# EAGLE design BarBot 2012 Tower (EAGLE 6.3)

## Sheet 1 of 2
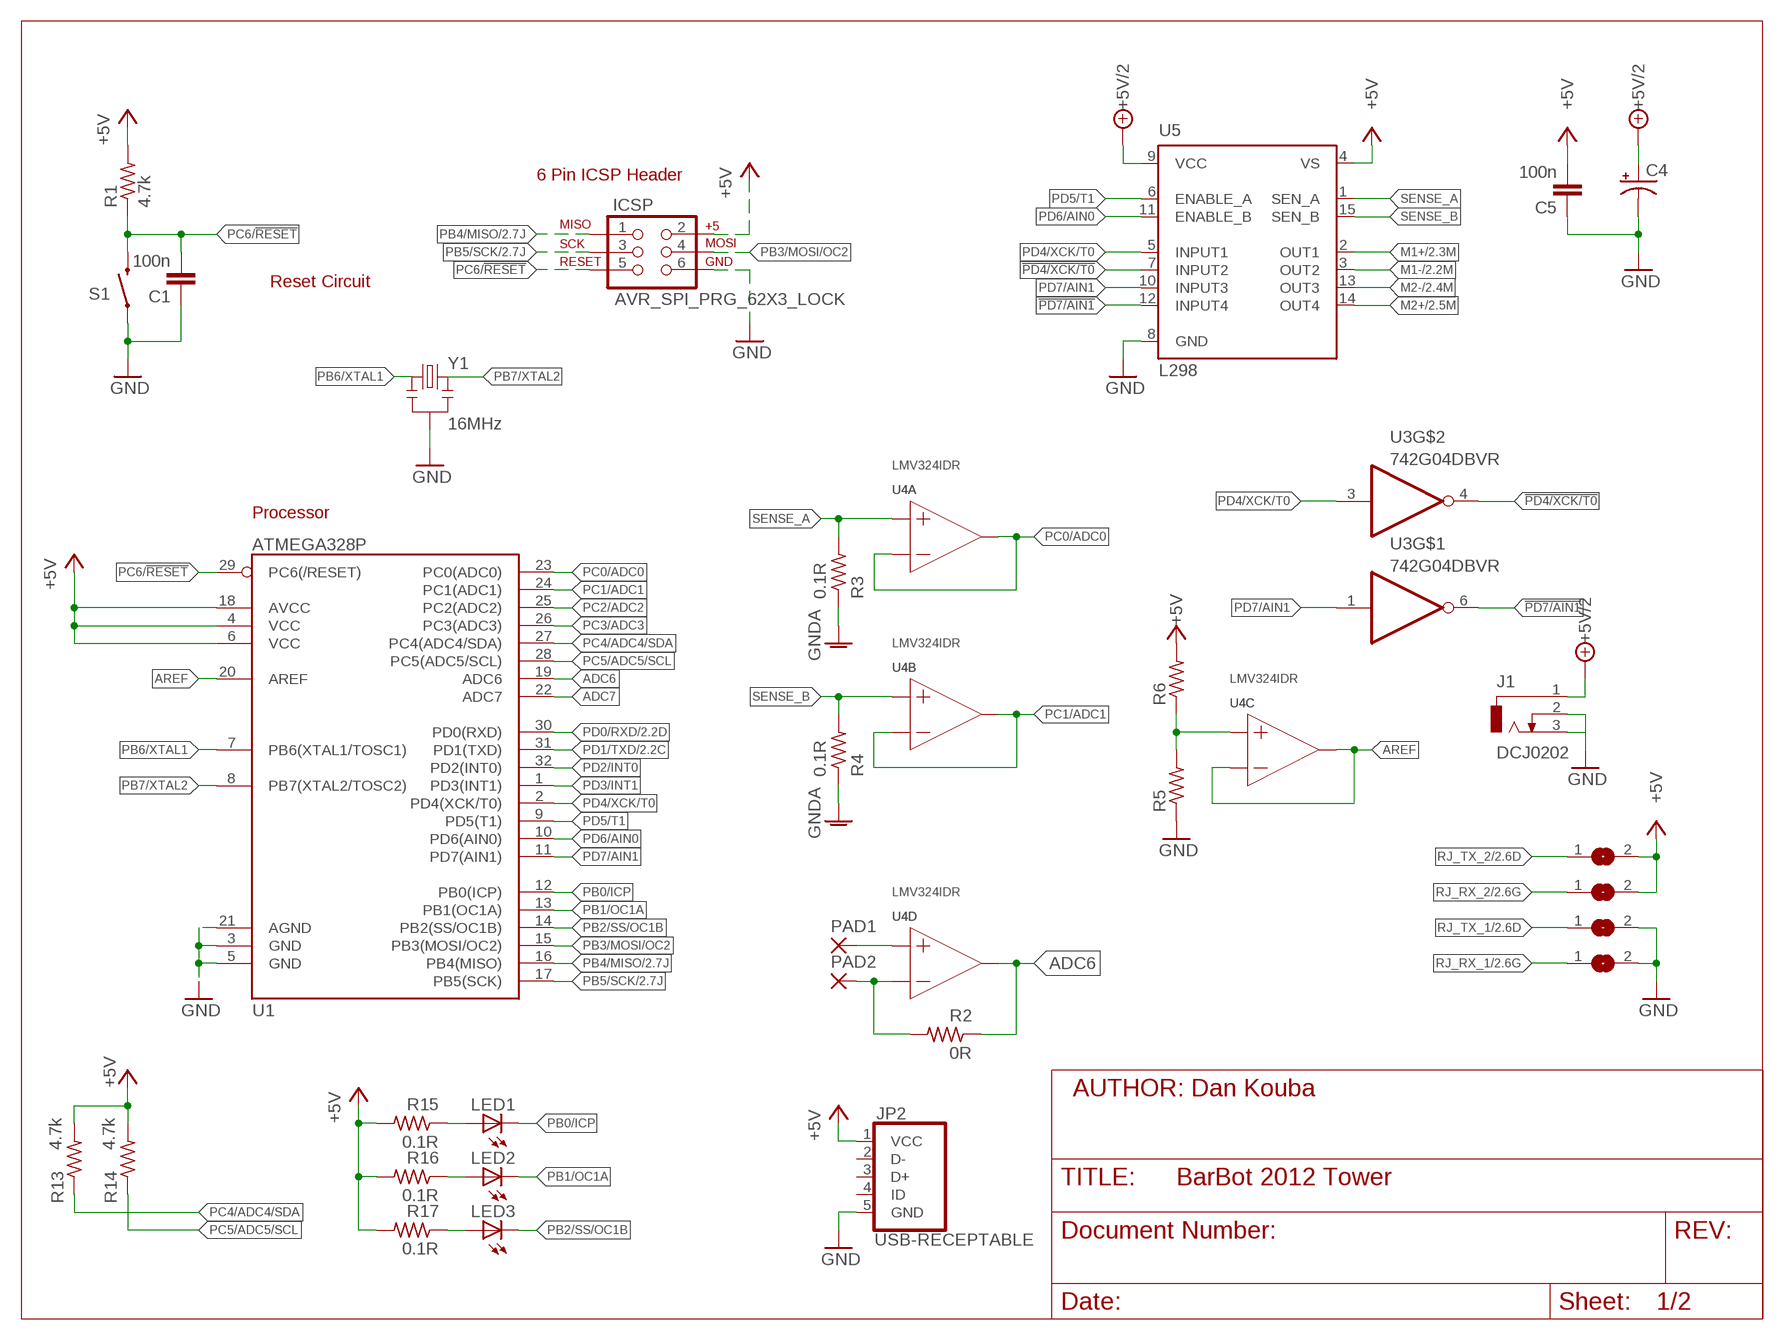
[diagram p0: schematic, sheet 1]

### Parts
C1  100n  C-EUC0805  [C0805]
C4  CPOL-USE3.5-8  [E3,5-8]
C5  100n  C-EUC0805  [C0805]
ICSP  AVR_SPI_PRG_62X3_LOCK  [2X3_LOCK]
J1  DCJ0202  [DCJ0202]
JP2  USB-RECEPTABLE  [FCI-10103594-0001LF]
LED1  LEDCHIPLED_0805  [CHIPLED_0805]
LED2  LEDCHIPLED_0805  [CHIPLED_0805]
LED3  LEDCHIPLED_0805  [CHIPLED_0805]
PAD1  1,6/0,8  [1,6/0,8]
PAD2  1,6/0,8  [1,6/0,8]
R1  4.7k  R-US_R0805  [R0805]
R2  0R  R-US_R0805  [R0805]
R3  0.1R  R-US_R0805  [R0805]
R4  0.1R  R-US_R0805  [R0805]
R5  R-US_R0805  [R0805]
R6  R-US_R0805  [R0805]
R13  4.7k  R-US_R0805  [R0805]
R14  4.7k  R-US_R0805  [R0805]
R15  0.1R  R-US_R0805  [R0805]
R16  0.1R  R-US_R0805  [R0805]
R17  0.1R  R-US_R0805  [R0805]
S1  SWITCH-MOMENTARY-2PTH  [TACTILE-PTH]
SJ1  SJ  [SJ]
SJ2  SJ  [SJ]
SJ3  SJ  [SJ]
SJ4  SJ  [SJ]
U1  ATMEGA328P  ATMEGA328_SMT  [TQFP32-08]
U3  742G04DBVR  [DBV_R-PDSO-G6]
U4  LMV324IDR  [SO14]
U5  L298  [MULTIWATT-15]
Y1  16MHz  RESONATOR16MHZ  [RESONATOR-SMD]

### Nets
!PD4/XCK/T0: U3.4(O) U5.7(INPUT2)
!PD7/AIN1: U3.6(O) U5.12(INPUT4)
+5V: C5.2 ICSP.2 JP2.1(VCC) R1.2 R6.2 R13.2 R14.2 R15.2 R16.2 R17.2 SJ3.2 SJ4.2 U1.4(VCC) U1.6(VCC) U1.18(AVCC) U5.4(VS) ; also sheet 2
+5V/2: C4.+ J1.1 U5.9(VCC) ; also sheet 2
ADC6: R2.1 U1.19(ADC6) U4.14(D:OUT)
ADC7: U1.22(ADC7)
AREF: U1.20(AREF) U4.8(C:OUT) U4.9(C:-IN)
GND: C1.1 C4.- C5.1 ICSP.6 J1.2 J1.3 JP2.5(GND) R3.1 R4.1 R5.1 S1.1 SJ1.2 SJ2.2 U1.3(GND) U1.5(GND) U1.21(AGND) U5.8(GND) Y1.2 ; supply symbol labelled GNDA ; also sheet 2
M1+: U5.2(OUT1) ; also sheet 2
M1-: U5.3(OUT2) ; also sheet 2
M2+: U5.14(OUT4) ; also sheet 2
M2-: U5.13(OUT3) ; also sheet 2
N$2: LED1.A R15.1
N$3: PAD2.1(P) R2.2 U4.13(D:-IN)
N$4: LED2.A R16.1
N$5: LED3.A R17.1
N$10: R5.2 R6.1 U4.10(C:+IN)
PB0/ICP: LED1.C U1.12(PB0(ICP))
PB1/OC1A: LED2.C U1.13(PB1(OC1A))
PB2/SS/OC1B: LED3.C U1.14(PB2(SS/OC1B))
PB3/MOSI/OC2: ICSP.4 U1.15(PB3(MOSI/OC2))
PB4/MISO: ICSP.1 U1.16(PB4(MISO)) ; also sheet 2
PB5/SCK: ICSP.3 U1.17(PB5(SCK)) ; also sheet 2
PB6/XTAL1: U1.7(PB6(XTAL1/TOSC1)) Y1.1
PB7/XTAL2: U1.8(PB7(XTAL2/TOSC2)) Y1.3
PC0/ADC0: U1.23(PC0(ADC0)) U4.1(A:OUT) U4.2(A:-IN)
PC1/ADC1: U1.24(PC1(ADC1)) U4.6(B:-IN) U4.7(B:OUT)
PC2/ADC2: U1.25(PC2(ADC2))
PC3/ADC3: U1.26(PC3(ADC3))
PC4/ADC4/SDA: R13.1 U1.27(PC4(ADC4/SDA))
PC5/ADC5/SCL: R14.1 U1.28(PC5(ADC5/SCL))
PC6/!RESET: C1.2 ICSP.5 R1.1 S1.3 U1.29(PC6(/RESET))
PD0/RXD: U1.30(PD0(RXD)) ; also sheet 2
PD1/TXD: U1.31(PD1(TXD)) ; also sheet 2
PD2/INT0: U1.32(PD2(INT0))
PD3/INT1: U1.1(PD3(INT1))
PD4/XCK/T0: U1.2(PD4(XCK/T0)) U3.3(I) U5.5(INPUT1)
PD5/T1: U1.9(PD5(T1)) U5.6(ENABLE_A)
PD6/AIN0: U1.10(PD6(AIN0)) U5.11(ENABLE_B)
PD7/AIN1: U1.11(PD7(AIN1)) U3.1(I) U5.10(INPUT3)
RJ_RX_1: SJ2.1 ; also sheet 2
RJ_RX_2: SJ4.1 ; also sheet 2
RJ_TX_1: SJ1.1 ; also sheet 2
RJ_TX_2: SJ3.1 ; also sheet 2
SENSE_A: R3.2 U4.3(A:+IN) U5.1(SEN_A)
SENSE_B: R4.2 U4.5(B:+IN) U5.15(SEN_B)
TP1: PAD1.1(P) U4.12(D:+IN)
Unconnected: JP2.2(D-) JP2.3(D+) JP2.4(ID)

### Notes on the sheet
- 6 Pin ICSP Header
- Reset Circuit
- Processor
- AUTHOR: Dan Kouba

## Sheet 2 of 2
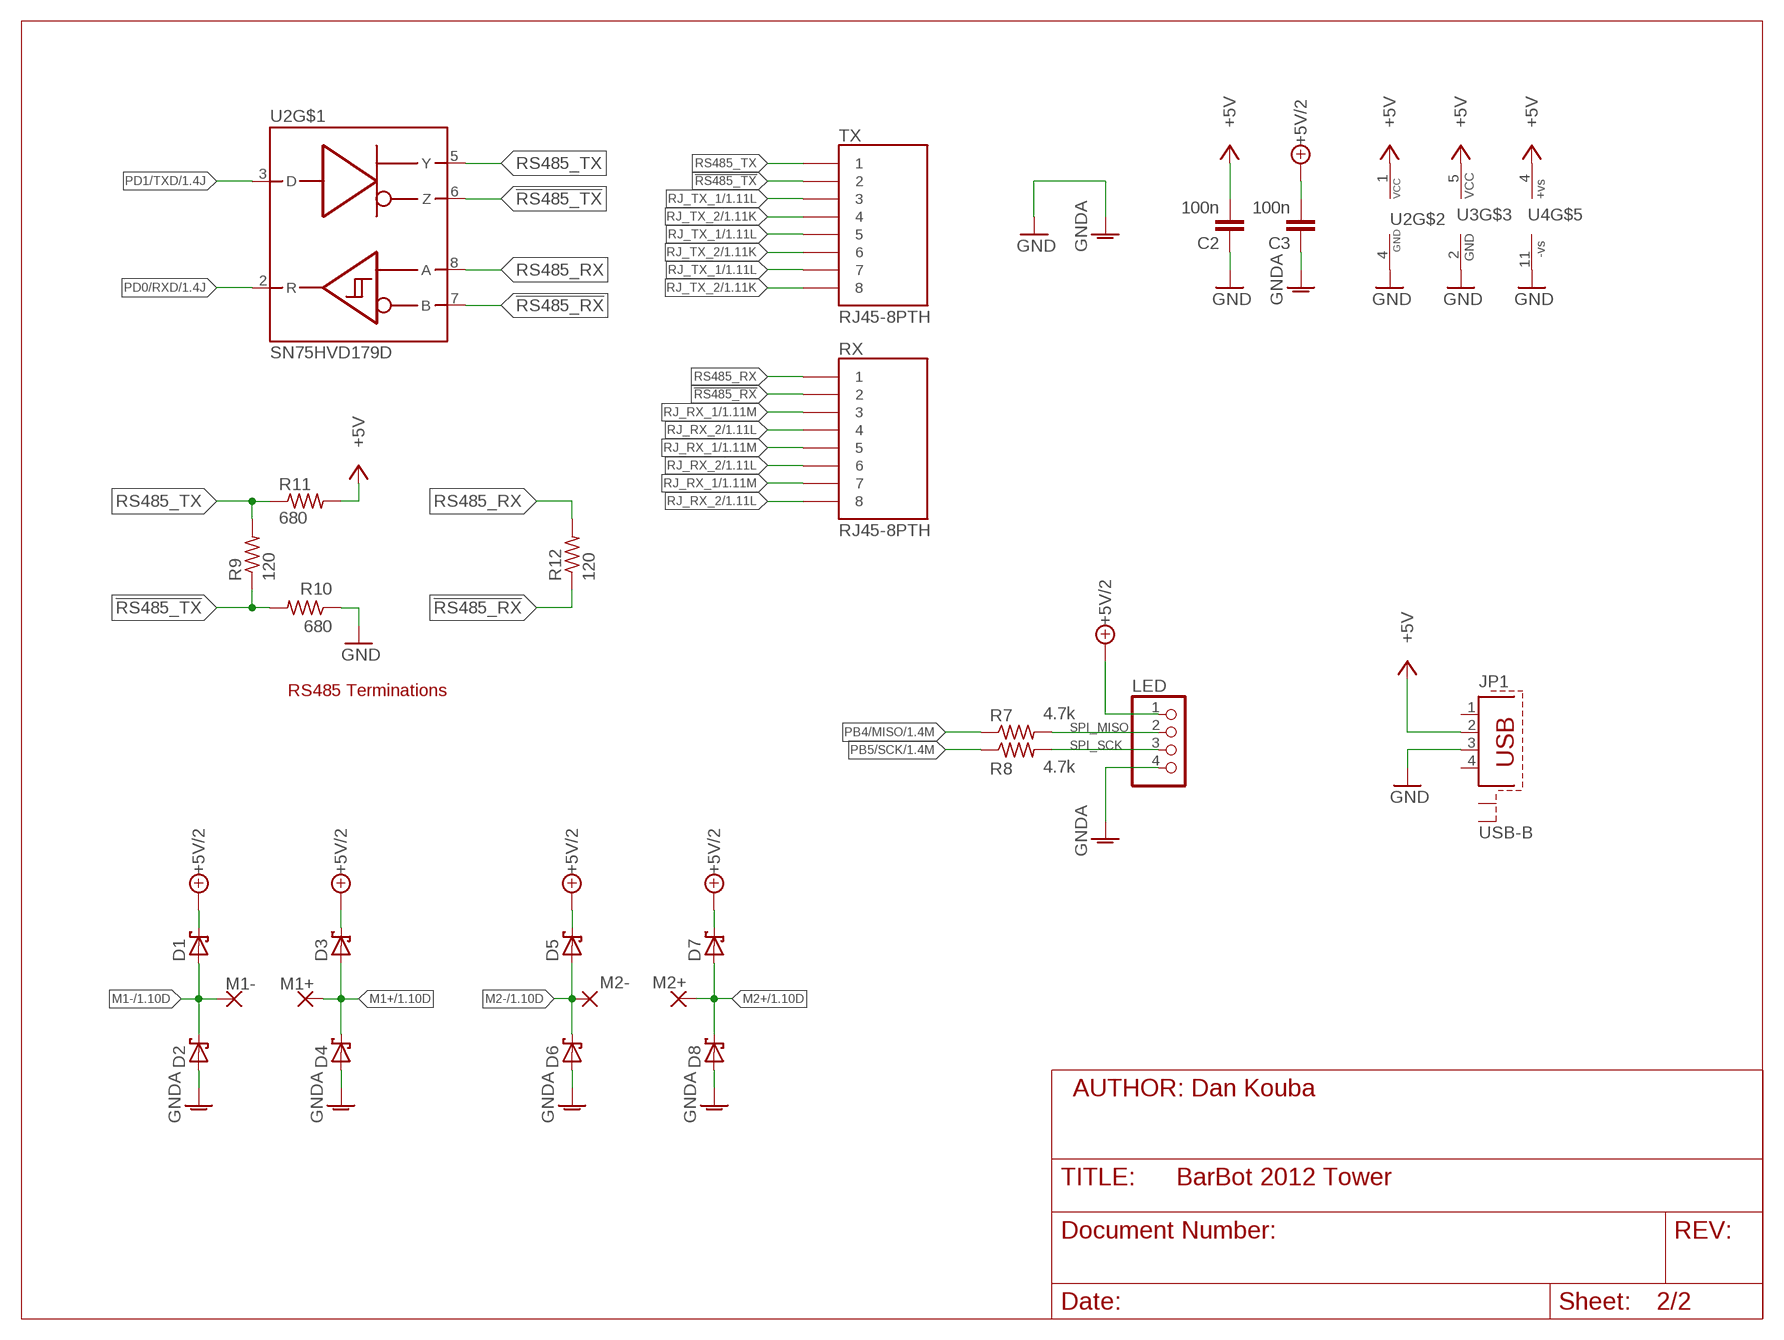
[diagram p1: schematic, sheet 2]

### Parts
C2  100n  C-EUC0805  [C0805]
C3  100n  C-EUC0805  [C0805]
D1  SCHOTTKY-DIODESMD  [SMB]
D2  SCHOTTKY-DIODESMD  [SMB]
D3  SCHOTTKY-DIODESMD  [SMB]
D4  SCHOTTKY-DIODESMD  [SMB]
D5  SCHOTTKY-DIODESMD  [SMB]
D6  SCHOTTKY-DIODESMD  [SMB]
D7  SCHOTTKY-DIODESMD  [SMB]
D8  SCHOTTKY-DIODESMD  [SMB]
JP1  USB-B  PN61729-S  [PN61729-S]
LED  PINHD-1X4  [1X04]
M1+  3,81/1,1  [3,81/1,1]
M1-  3,81/1,1  [3,81/1,1]
M2+  3,81/1,1  [3,81/1,1]
M2-  3,81/1,1  [3,81/1,1]
R7  4.7k  R-US_R0805  [R0805]
R8  4.7k  R-US_R0805  [R0805]
R9  120  R-US_R0805  [R0805]
R10  680  R-US_R0805  [R0805]
R11  680  R-US_R0805  [R0805]
R12  120  R-US_R0805  [R0805]
RX  RJ45-8PTH  [RJ45-8]
TX  RJ45-8PTH  [RJ45-8]
U2  SN75HVD179D  [SO-08]

### Nets
!RS485_RX: R12.1 RX.2 U2.7(B)
!RS485_TX: R9.1 R10.2 TX.2 U2.6(Z)
+5V: C2.2 JP1.2 R11.2 U2.1(VCC) U3.5(VCC) U4.4(+VS) ; also sheet 1
+5V/2: C3.2 D1.C D3.C D5.C D7.C LED.1 ; also sheet 1
GND: C2.1 C3.1 D2.A D4.A D6.A D8.A JP1.3 LED.4 R10.1 U2.4(GND) U3.2(GND) U4.11(-VS) ; supply symbol labelled GNDA ; also sheet 1
M1+: D3.A D4.C M1+.1(P) ; also sheet 1
M1-: D1.A D2.C M1-.1(P) ; also sheet 1
M2+: D7.A D8.C M2+.1(P) ; also sheet 1
M2-: D5.A D6.C M2-.1(P) ; also sheet 1
PB4/MISO: R7.1 ; also sheet 1
PB5/SCK: R8.1 ; also sheet 1
PD0/RXD: U2.2(R) ; also sheet 1
PD1/TXD: U2.3(D) ; also sheet 1
RJ_RX_1: RX.3 RX.5 RX.7 ; also sheet 1
RJ_RX_2: RX.4 RX.6 RX.8 ; also sheet 1
RJ_TX_1: TX.3 TX.5 TX.7 ; also sheet 1
RJ_TX_2: TX.4 TX.6 TX.8 ; also sheet 1
RS485_RX: R12.2 RX.1 U2.8(A)
RS485_TX: R9.2 R11.1 TX.1 U2.5(Y)
SPI_MISO: LED.2 R7.2
SPI_SCK: LED.3 R8.2
Unconnected: JP1.1 JP1.4 JP1.S1 JP1.S2

### Notes on the sheet
- RS485 Terminations
- AUTHOR: Dan Kouba

## Library data of the parts
C1-C3 C5 = rcl:C-EU: CAPACITOR, European symbol
C4 = rcl:CPOL-US: POLARIZED CAPACITOR, American symbol
D1-D8 = diode:SCHOTTKY-DIODE: Schottky Diode; DIGIKEY_PN: S320FSCT-ND
ICSP = SparkFun-Connectors:AVR_SPI_PRG_6: AVR ISP 6 Pin This is the reduced ISP connector for AVR programming. Common on Arduino. This footprint will take up less PCB space and can be used with a 10-pin to 6-pin adapter such as SKU: BOB-08508
J1 = con-jack:DCJ0202: DC POWER JACK Source: DCJ0202.pdf; OC_FARNELL: unknown; OC_NEWARK: unknown
JP1 = con-berg:PN61729-S: BERG USB connector; OC_FARNELL: unknown; OC_NEWARK: unknown
JP2 = daspilker:USB-RECEPTABLE: USB Receptable
LED = pinhead:PINHD-1X4: PIN HEADER
LED1-LED3 = led:LED: LED OSRAM: - CHIPLED LG R971, LG N971, LY N971, LG Q971, LY Q971, LO R971, LY R971 LH N974, LH R974 LS Q976, LO Q976, LY Q976 LO Q996 - Hyper CHIPLED LW Q18S LB Q993, LB Q99A, LB R99A - SideLED LS A670, LO A670, LY A670, LG A670, LP A670 LB A673, LV A673, LT A673, LW A673 LH A674 LY A675 LS A676, LA A676, LO A676, LY A676, LW A676 LS A679, LY A679, LG A679 - Hyper Micro SIDELED® LS Y876, LA Y876, LO Y876, LY Y876 LT Y87S - SmartLED LW L88C, LW L88S LB L89C, LB L89S, LG L890 LS L89K, LO L89K, LY L89K LS L896, LA L896, LO L896, LY L896 - TOPLED LS T670, LO T670, LY T670, LG T670, LP T670 LSG T670, LSP T670, LSY T670, LOP T670, LYG T670 LG T671, LOG T671, LSG T671 LB T673, LV T673, LT T673, LW T673 LH T674 LS T676, LA T676, LO T676, LY T676, LB T676, LH T676, LSB T676, LW T676 LB T67C, LV T67C, LT T67C, LS T67K, LO T67K, LY T67K, LW E67C LS E67B, LA E67B, LO E67B, LY E67B, LB E67C, LV E67C, LT E67C LW T67C LS T679, LY T679, LG T679 LS T770, LO T770, LY T770, LG T770, LP T770 LB T773, LV T773, LT T773, LW T773 LH T774 LS E675, LA E675, LY E675, LS T675 LS T776, LA T776, LO T776, LY T776, LB T776 LHGB T686 LT T68C, LB T68C - Hyper Mini TOPLED® LB M676 - Mini TOPLED Santana® LG M470 LS M47K, LO M47K, LY M47K Source: http://www.osram.convergy.de LUXEON: - LUMILED® LXK2-PW12-R00, LXK2-PW12-S00, LXK2-PW14-U00, LXK2-PW14-V00 LXK2-PM12-R00, LXK2-PM12-S00, LXK2-PM14-U00 LXK2-PE12-Q00, LXK2-PE12-R00, LXK2-PE12-S00, LXK2-PE14-T00, LXK2-PE14-U00 LXK2-PB12-K00, LXK2-PB12-L00, LXK2-PB12-M00, LXK2-PB14-N00, LXK2-PB14-P00, LXK2-PB14-Q00 LXK2-PR12-L00, LXK2-PR12-M00, LXK2-PR14-Q00, LXK2-PR14-R00 LXK2-PD12-Q00, LXK2-PD12-R00, LXK2-PD12-S00 LXK2-PH12-R00, LXK2-PH12-S00 LXK2-PL12-P00, LXK2-PL12-Q00, LXK2-PL12-R00 Source: www.luxeon.com KINGBRIGHT: KA-3528ASYC Source: www.kingbright.com
M1+ M1- M2+ M2- = wirepad:3,81/1,1: THROUGH-HOLE PAD
PAD1 PAD2 = wirepad:1,6/0,8: THROUGH-HOLE PAD
R1 R5-R12 = rcl:R-US_: RESISTOR, American symbol
R2-R4 R13-R17 = rcl:R-US_: RESISTOR, American symbol; DIGIKEY_PN: RHM.10MCT-ND
RX TX = SparkFun-Connectors:RJ45-8: RJ45 Jack Simple RJ45, 8-pin connection - connector for common Cat5, Cat5e, and Cat6 Ethernet cables. Footprint not yet proven in production. Connector sku is PRT-00643; Breakout PCB sku is BOB-00716.
S1 = SparkFun-Electromechanical:SWITCH-MOMENTARY-2: Various NO switches- pushbuttons, reed, etc
SJ1-SJ4 = jumper:SJ: SMD solder JUMPER
U1 = SparkFun-DigitalIC:ATMEGA328_SMT: 32-Pin Atmega328 part Commonly used on Arduino compatible boards Available in QFP and QFN packages TQFP is IC-09069 QFN is non-stock; PROD_ID: IC-09069
U2 = texas:SN75HVD179: 5V FULL-DUPLEX RS-485/RS-422 DRIVER AND BALANCED RECEIVER - Up to 64 nodes per bus - 15kV ESD protection - Bus-Fault protection of -7V to 12V - SOIC8 Package
U3 = 74xx-little-us:74*2G04
U4 = bb_parts_OpAmp:LMV324: LOW-VOLTAGE RAIL-TO-RAIL OUTPUT OPERATIONAL AMPLIFIERS
U5 = st-microelectronics:L298: DUAL FULL-BRIDGE DRIVER; MPN: L298N; OC_FARNELL: 1589425; OC_NEWARK: 32M1527
Y1 = SparkFun-FreqCtrl:RESONATOR: Resonator Small SMD resonator. Used, eg, on the Arduino Pro/ Pro Mini boards. 8MHz- XTAL-08895 16MHz- XTAL-08900; PROD_ID: XTAL-08900

## Board
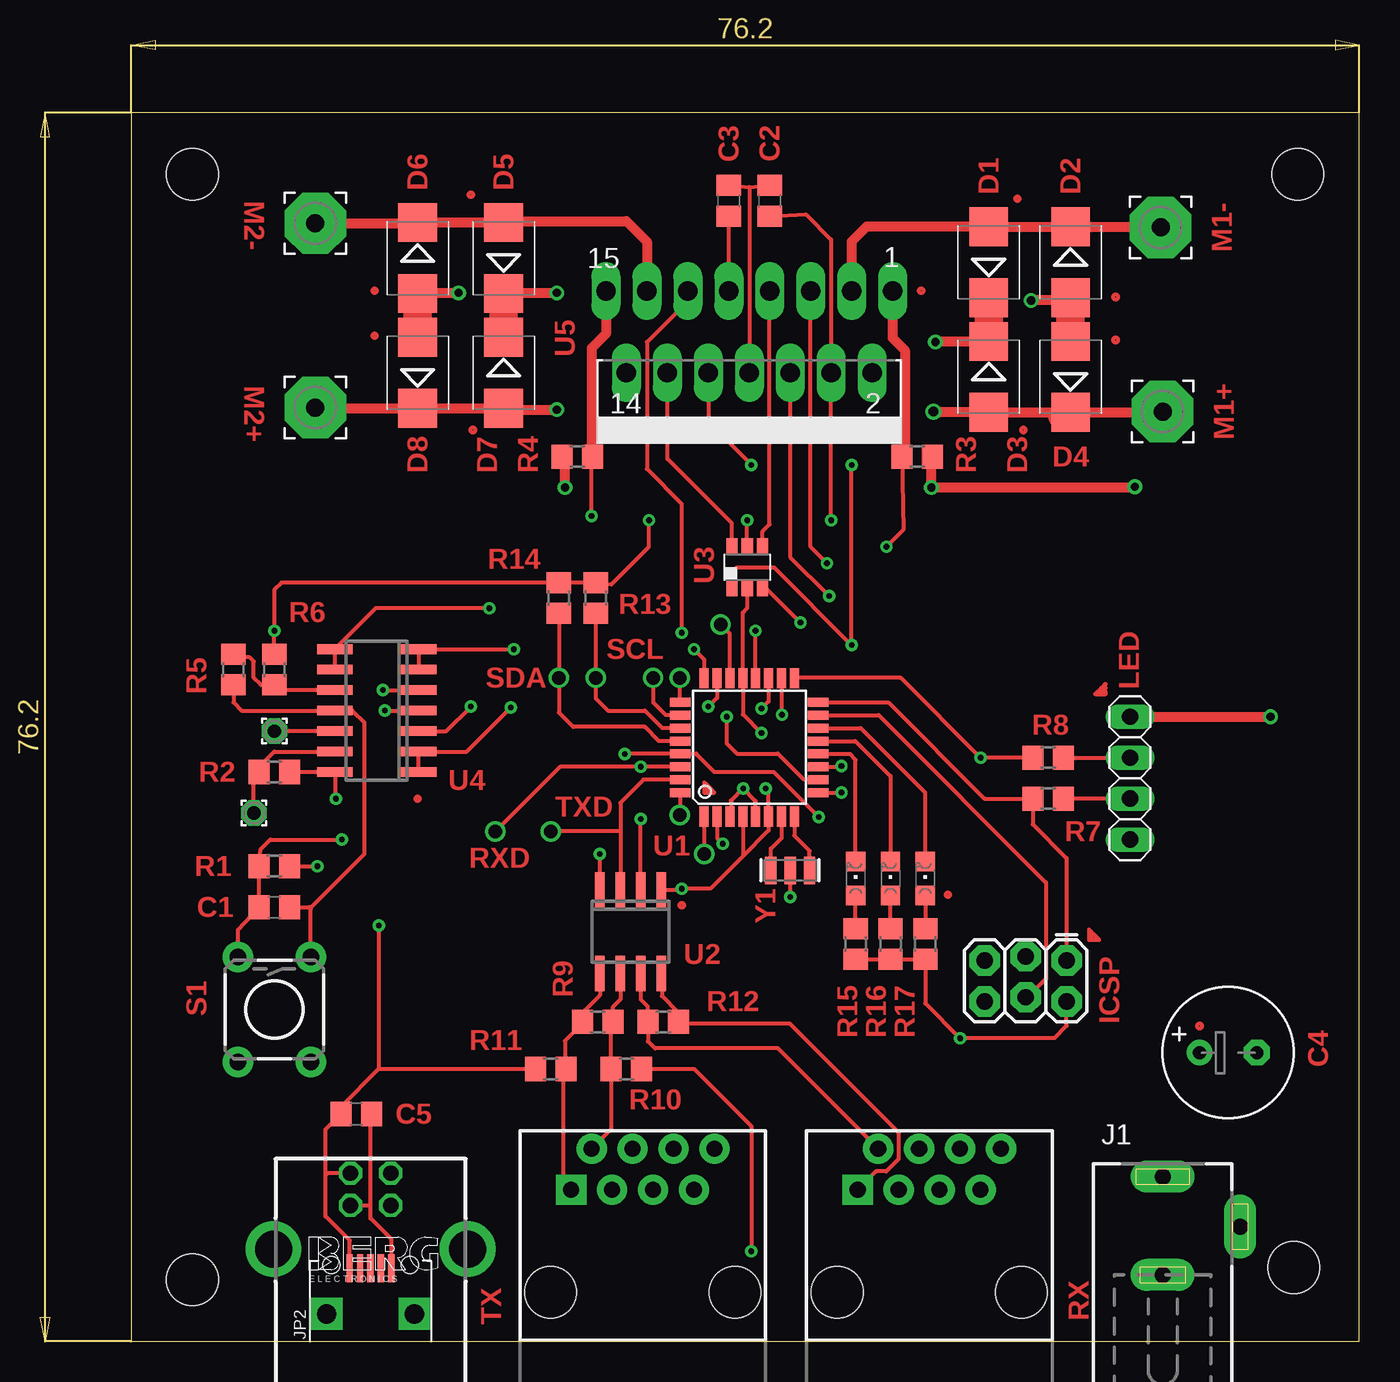
[diagram p2: board, top side]
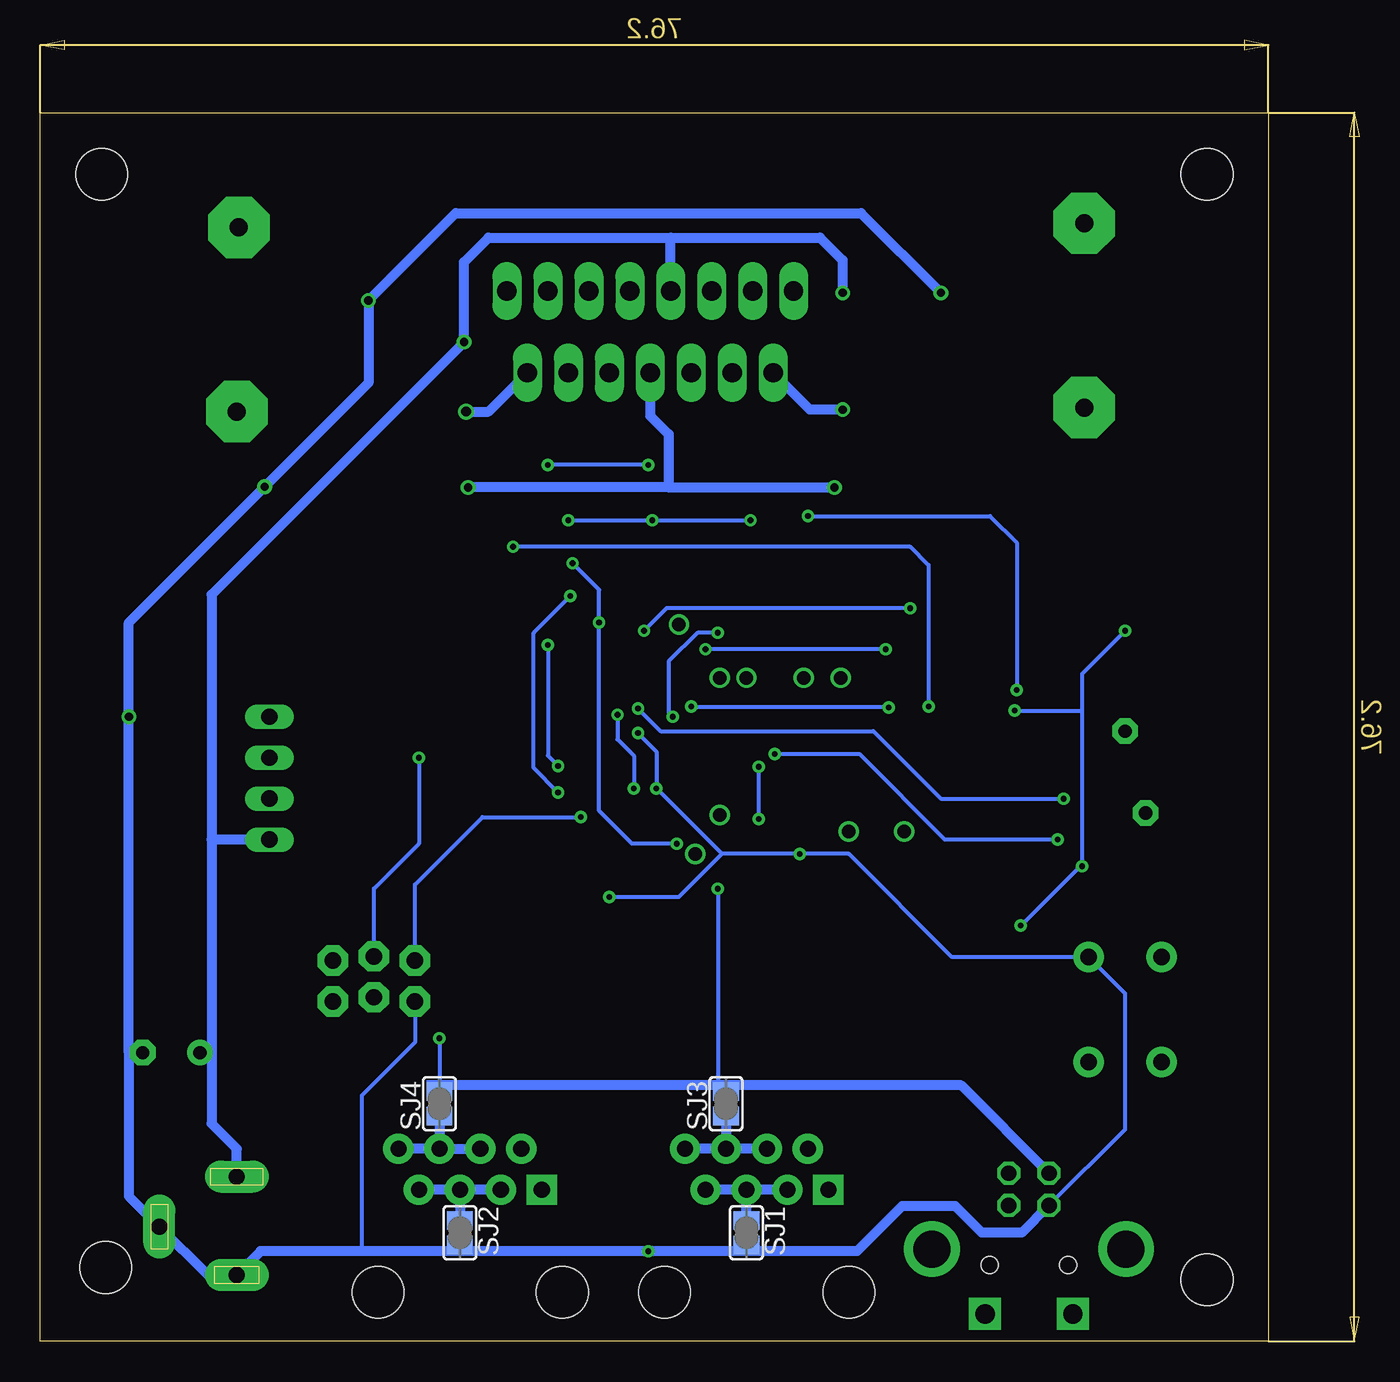
[diagram p3: board, bottom side, seen from below]

Size 76.2 x 76.2 mm. Coordinates in mm from the lower left corner, seen from the top.
Outline: 0,0 76.2,0 76.2,76.2 0,76.2 0,0
Copper layers (1*16): Top 0.0178mm / dielectric 59mil / Bottom 0.0178mm
Design rules "SSC-EAGLE-2Lyr_v1.0.0.3": minimum track width 6mil, minimum drill 14mil, track to track 6mil, track to pad 6mil, pad to pad 6mil, via to via 6mil, smd to smd 6mil, copper to edge 20mil, drill to drill 16mil, minimum pad ring 8mil, minimum via ring 8mil, stop-mask expansion 3mil, vias tented up to drill 0mil, thermal gap 10mil
Holes 3.2 mm at 3.81,72.39 72.39,72.39 72.14,4.57 3.81,3.81

### Footprints (pad centres in the part's own frame; a part is rotated, then mirrored left to right if it is on the bottom)
C0805 = smd 1.3 x 1.5: 1 -0.95,0; 2 0.95,0
E3,5-8 = drill 0.813 pad 1.6: + -1.778,0 | drill 0.813 pad 1.6 octagon: - 1.778,0
SMB = smd 2.4 x 2.4: A 2.2,0; C -2.2,0
2X3_LOCK = drill 1.016 pad 1.88 octagon: 1 0,0; 2 0,2.54; 3 2.54,-0.254; 4 2.54,2.286; 5 5.08,0; 6 5.08,2.54
DCJ0202 = drill 1 pad 2 long: 1 0,3.1; 2 4.8,0; 3 0,-3
PN61729-S = drill 0.95 octagon: 1 1.25,4.71; 2 -1.25,4.71; 3 -1.25,2.71; 4 1.25,2.71 | drill 2.3 pad 2.9: S1 -6.02,0; S2 6.02,0
FCI-10103594-0001LF = smd 0.4 x 1.75: 1 -1.3,4.525; 2 -0.65,4.525; 3 0,4.525; 4 0.65,4.525; 5 1.3,4.525 | drill 1.2 pad 2 square: P$3 -2.725,1.7; P$4 2.725,1.7 | hole 1.05: -2.425,4.73; 2.425,4.73
1X04 = drill 1.016 long: 1 -3.81,0; 2 -1.27,0; 3 1.27,0; 4 3.81,0
CHIPLED_0805 = smd 1.2 x 1.2: A 0,-1.05; C 0,1.05
3,81/1,1 = drill 1.118 pad 3.81 octagon: 1 0,0
1,6/0,8 = drill 0.813 pad 1.6 octagon: 1 0,0
R0805 = smd 1.3 x 1.5: 1 -0.95,0; 2 0.95,0
RJ45-8 = drill 1 pad 1.88 square: 1 -4.445,6.35 | drill 1 pad 1.88: 2 -3.175,8.89; 3 -1.905,6.35; 4 -0.635,8.89; 5 0.635,6.35; 6 1.905,8.89; 7 3.175,6.35; 8 4.445,8.89 | hole 3.2: -5.715,0; 5.715,0
TACTILE-PTH = drill 1.016 pad 1.88: 1 -3.251,2.261; 2 3.251,2.261; 3 -3.251,-2.261; 4 3.251,-2.261
SJ = smd 1.168 x 1.6: 1 -0.762,0; 2 0.762,0
TQFP32-08 = smd 1.27 x 0.559: 1 -4.293,2.8; 2 -4.293,2; 3 -4.293,1.2; 4 -4.293,0.4; 5 -4.293,-0.4; 6 -4.293,-1.2; 7 -4.293,-2; 8 -4.293,-2.8; 17 4.293,-2.8; 18 4.293,-2; 19 4.293,-1.2; 20 4.293,-0.4; 21 4.293,0.4; 22 4.293,1.2; 23 4.293,2; 24 4.293,2.8 | smd 0.559 x 1.27: 9 -2.8,-4.293; 10 -2,-4.293; 11 -1.2,-4.293; 12 -0.4,-4.293; 13 0.4,-4.293; 14 1.2,-4.293; 15 2,-4.293; 16 2.8,-4.293; 25 2.8,4.293; 26 2,4.293; 27 1.2,4.293; 28 0.4,4.293; 29 -0.4,4.293; 30 -1.2,4.293; 31 -2,4.293; 32 -2.8,4.293
SO-08 = smd 0.6 x 2.2: 1 -1.905,-2.6; 2 -0.635,-2.6; 3 0.635,-2.6; 4 1.905,-2.6; 5 1.905,2.6; 6 0.635,2.6; 7 -0.635,2.6; 8 -1.905,2.6
DBV_R-PDSO-G6 = smd 0.69 x 0.99: 1 -0.95,-1.29; 2 0,-1.29; 3 0.95,-1.29; 4 0.95,1.3; 5 0,1.3; 6 -0.95,1.3
SO14 = smd 0.6 x 2.2: 1 -3.81,-2.6; 2 -2.54,-2.6; 3 -1.27,-2.6; 4 0,-2.6; 5 1.27,-2.6; 6 2.54,-2.6; 7 3.81,-2.6; 8 3.81,2.6; 9 2.54,2.6; 10 1.27,2.6; 11 0,2.6; 12 -1.27,2.6; 13 -2.54,2.6; 14 -3.81,2.6
MULTIWATT-15 = drill 1.2 long: 1 -8.89,-7.62; 2 -7.62,-2.54; 3 -6.35,-7.62; 4 -5.08,-2.54; 5 -3.81,-7.62; 6 -2.54,-2.54; 7 -1.27,-7.62; 8 0,-2.54; 9 1.27,-7.62; 10 2.54,-2.54; 11 3.81,-7.62; 12 5.08,-2.54; 13 6.35,-7.62; 14 7.62,-2.54; 15 8.89,-7.62
RESONATOR-SMD = smd 0.7 x 1.7: 1 -1.2,0; 2 0,0; 3 1.2,0

### Placement (x,y rotation side)
C1  8.89,26.92 180 top
C2  39.62,70.74 270 top
C3  37.08,70.74 270 top
C4  68.07,17.91 0 top
C5  13.97,14.1 180 top
D1  53.21,66.93 90 top
D2  58.29,66.93 270 top
D3  53.21,59.82 270 top
D4  58.29,59.82 90 top
D5  23.11,67.18 90 top
D6  17.78,67.18 270 top
D7  23.11,60.07 270 top
D8  17.78,60.07 90 top
ICSP  58.04,23.62 180 top
J1  64.01,7.11 0 top
JP1  14.86,5.71 0 top
JP2  14.86,0 0 top
LED  61.98,34.92 90 top
LED1  44.96,28.7 0 top
LED2  47.12,28.7 0 top
LED3  49.28,28.7 0 top
M1+  64.01,57.66 0 top
M1-  63.88,69.09 0 top
M2+  11.43,57.91 0 top
M2-  11.43,69.34 0 top
PAD1  8.89,37.85 0 top
PAD2  7.62,32.77 0 top
R1  8.89,29.46 0 top
R2  8.89,35.31 180 top
R3  48.77,54.86 180 top
R4  27.69,54.86 0 top
R5  6.35,41.66 90 top
R6  8.89,41.66 90 top
R7  56.9,33.66 0 top
R8  56.9,36.2 0 top
R9  28.96,19.81 180 top
R10  30.73,16.89 180 top
R11  26.04,16.89 180 top
R12  33.02,19.81 0 top
R13  28.83,46.1 90 top
R14  26.54,46.1 90 top
R15  44.96,24.64 270 top
R16  47.12,24.64 270 top
R17  49.28,24.64 270 top
RX  49.53,3.05 0 top
S1  8.89,20.57 270 top
SJ1  32.38,6.73 270 bottom
SJ2  50.16,6.73 270 bottom
SJ3  33.66,14.73 90 bottom
SJ4  51.44,14.73 90 bottom
TX  31.75,3.05 0 top
U1  38.35,36.83 90 top
U2  30.99,25.4 180 top
U3  38.23,48.01 0 top
U4  15.24,39.12 90 top
U5  38.35,57.53 180 top
Y1  40.89,29.21 0 top

### Tracks (layer width: path | path; a pad name or v marks a point on that pad's centre or on a via)
!PD4/XCK/T0
  Top 0.254: U3.4 39.18,50.23 39.62,50.67 U5.7
!PD7/AIN1
  Top 0.254: U3.6 37.28,50.73 33.27,54.74 U5.12
!RS485_RX
  Top 0.254: U2.7 31.62,21.21 32.07,20.76 R12.1 32.07,18.6 32.51,18.16 40.13,18.16 RX.2
!RS485_TX
  Top 0.254: 29.97,19.65 R9.1 | U2.6 30.35,21.21 29.91,20.76 R9.1 | TX.2 29.78,13.15 R10.2 29.78,19.69 R9.1
  Top 0.406: 29.88,17.02 R10.2 | 29.88,19.73 R9.1
+5V  (via drill 0.36)
  Top 0.254: R1.2 v11.56,29.46 | 37.95,30.08 39.55,31.68 U1.6 39.55,34.11 v39.37,34.29 | U1.4 37.95,30.08 | U1.18 40.35,38.89 v40.39,38.86 | U3.5 v38.23,50.93 | v32.13,50.93 32.13,49.28 29.81,46.95 R13.2 R14.2 9.33,47.05 8.89,46.61 v8.89,44.07 R6.2 | 15.37,16.89 R11.2 | v15.75,39.12 U4.4 | v43.43,50.93 U5.4 43.43,68.33 41.87,69.89 C2.2 | 44.92,23.75 R15.2 R16.2 R17.2 49.28,20.95 v51.44,18.8 57.28,18.8 58.04,19.56 ICSP.2 | JP2.1 13.56,6.25 12.06,7.75 12.06,10.29 | 12.06,10.29 12.06,13.14 C5.2 13.02,14.54 15.37,16.89 | JP1.2 12.2,10.43 12.06,10.29 | U2.1 34.1,28 v34.16,28.07 35.94,28.07 37.95,30.08 | v15.37,25.78 15.37,16.89
  Top 0.406: R6.2 8.98,42.51
  Bottom 0.254: v40.39,38.86 40.39,37.34 39.37,36.32 v39.37,34.29 | v32.13,50.93 v38.23,50.93 v43.43,50.93 | v11.56,29.46 11.56,29.59 | 11.56,29.59 11.56,39.12 | v15.75,39.12 11.56,39.12 | 11.56,39.12 11.56,41.4 v8.89,44.07 | v51.44,18.8 SJ4.2 | v34.16,28.07 34.16,16 34.29,15.88 | 11.56,29.59 v15.37,25.78
  Bottom 0.61: JP1.2 19.06,15.88 33.66,15.88 | 33.66,15.88 34.29,15.88 51.69,15.88 | 51.69,15.88 51.82,15.88 | SJ3.2 33.66,15.88 | SJ4.2 51.69,15.75 51.69,15.88
+5V/2  (via drill 0.51)
  Top 0.254: U5.9 C3.2
  Top 0.61: v49.91,61.98 49.95,62.02 D3.C | D5.C 23.16,65.02 v26.42,65.02
  Top 1.27: 53.25,61.98 D3.C | 23.07,62.23 D7.C
  Top 1.778: D5.C D7.C | D1.C D3.C
  Bottom 0.61: 37.08,68.45 48.39,68.45 49.91,66.93 v49.91,61.98 65.57,46.31 65.57,31.11 | 37.08,68.45 27.81,68.45 26.42,67.06 v26.42,65.02 | U5.9 37.08,68.45 | 65.57,31.11 65.57,17.78 | LED.1 65.57,31.11 | C4.+ 65.7,17.91 65.57,17.78 | 65.57,17.78 65.57,13.5 64.01,11.94 J1.1
ADC6  (via drill 0.36)
  Top 0.254: R2.1 U4.14 12.7,35.25 v12.7,33.66 | U1.19 39.55,39.68 v39.12,39.24
  Top 0.305: 10.16,34.89 R2.1
  Bottom 0.254: v39.12,39.24 37.72,37.85 24.51,37.85 20.32,33.66 v12.7,33.66
ADC7  (via drill 0.84)
  Top 0.254: U1.22 37.15,43.87 v36.58,44.45
AREF  (via drill 0.36)
  Top 0.254: U4.9 U4.8 15.18,45.47 v22.23,45.47 | U1.20 38.75,44.05 v38.73,44.07
  Bottom 0.254: v22.23,45.47 37.34,45.47 v38.73,44.07
GND  (via drill 0.36, 0.51)
  Top 0.254: U1.5 38.75,33.51 v37.97,34.29 37.21,33.53 37.21,32.59 | U2.4 v29.08,30.23 | C1.1 11.05,26.92 | S1.1 11.15,26.82 11.05,26.92 | 11.05,26.92 11.18,26.92 14.48,30.23 14.48,38.35 13.72,39.12 U4.11 6.86,39.12 6.35,39.62 R5.1 | Y1.2 v40.89,27.56 | v39.12,37.72 37.95,38.88 U1.21 37.95,45.19 38.23,45.47 U3.2 | C3.1 38.35,71.59 | 38.35,71.59 C2.1 | 38.35,71.59 U5.8 | JP2.5 16.16,6.32 14.86,7.62 14.86,8.51 | 14.86,8.51 14.86,13.91 C5.1 | JP1.3 14.78,8.43 14.86,8.51 | R10.1 34.92,16.89 38.48,13.34 v38.48,5.59
  Top 0.406: 37.21,32.59 U1.3
  Top 0.61: LED.4 v70.7,38.73 | 58.12,64.77 57.91,64.56 v55.84,64.56 | 17.82,65.02 v20.32,65.02 | v26.92,52.96 26.92,54.78 R4.1 | v62.27,53 62.23,52.96 v49.66,52.96 49.66,54.83 R3.1
  Top 1.27: 17.74,62.23 D8.A 17.78,62.23 | 58.29,61.98 D4.A | 58.12,64.77 D2.A | 17.82,65.02 D6.A
  Top 1.778: D6.A D8.A | D2.A D4.A
  Bottom 0.254: 33.91,30.23 v29.08,30.23 26.04,30.23 19.63,23.82 S1.1 8.89,21.57 8.89,13.14 JP1.3 | 33.91,30.23 v37.97,34.29 37.97,36.58 v39.12,37.72 | v40.89,27.56 36.58,27.56 33.91,30.23 | ICSP.6 52.96,18.54 56.26,15.24 56.26,5.84 56.52,5.59
  Bottom 0.61: 70.7,17.91 v70.7,38.73 70.7,44.58 v62.27,53 55.84,59.44 v55.84,64.56 50.42,69.98 25.27,69.98 v20.32,65.02 | U5.8 38.35,57.4 37.21,56.26 37.21,52.96 | 37.21,52.96 v26.92,52.96 | 37.21,52.96 v49.66,52.96 | C4.- 70.7,17.91 | 70.7,17.91 70.7,9 J1.2 65.81,4.11 J1.3 62.53,5.59 56.52,5.59 50.16,5.59 | JP1.3 15.3,6.73 17.78,6.73 19.43,8.38 22.73,8.38 25.53,5.59 32.38,5.59 | 32.38,5.59 v38.48,5.59 50.16,5.59 | SJ1.2 32.38,5.59 | SJ2.2 50.16,5.59
M1+  (via drill 0.6)
  Top 0.254: 63.97,57.62 M1+.1
  Top 0.61: 63.97,57.62 D4.C D3.A 49.83,57.62 v49.78,57.66
  Top 1.778: 57.78,57.4 57.87,57.49 D4.C
  Bottom 0.61: v49.78,57.66 48.39,57.66 U5.2
M1-
  Top 0.254: 63.84,69.13 M1-.1
  Top 0.61: 63.84,69.13 D2.C D1.A 45.63,69.13 44.7,68.2 U5.3
M2+  (via drill 0.51)
  Top 0.254: 11.47,57.87 M2+.1
  Top 0.61: 11.47,57.87 D8.C D7.A 23.2,57.78 v26.42,57.78
  Bottom 0.61: v26.42,57.78 28.45,57.78 U5.14
M2-
  Top 0.61: U5.13 32,68.2 30.73,69.47 23.2,69.47 D5.A D6.C | M2-.1 17.74,69.34
  Top 1.27: D6.C 17.74,69.34
N$1
  Top 0.254: 59.56,24.89 59.44,24.89 59.44,25.53 59.56,25.4 | 59.56,24.89 59.82,24.89 | 59.82,24.89 60.07,24.89 59.82,25.15 | 59.82,25.15 59.56,25.4 | 59.56,25.4 59.56,24.89 | 59.82,25.15 59.82,24.89
N$2
  Top 0.254: R15.1 LED1.A
N$3
  Top 0.254: PAD2.1 7.62,34.89 | 8.04,35.73 8.89,36.58 U4.13
  Top 0.305: 7.62,34.89 R2.2 8.04,35.73
N$4
  Top 0.254: R16.1 LED2.A
N$5
  Top 0.254: LED3.A R17.1
N$6
  Top 0.254: 60.45,40.26 60.45,40.13 59.82,40.13 59.94,40.26 | 60.45,40.26 60.45,40.51 | 60.45,40.51 60.45,40.77 60.2,40.51 | 60.2,40.51 59.94,40.26 | 59.94,40.26 60.45,40.26 | 60.2,40.51 60.45,40.51
N$7
  Top 0.254: 35.69,34.04 35.56,34.04 35.56,34.67 35.69,34.54 | 35.69,34.04 35.94,34.04 | 35.94,34.04 36.2,34.04 35.94,34.29 | 35.94,34.29 35.69,34.54 | 35.69,34.54 35.69,34.04 | 35.94,34.29 35.94,34.04
N$10
  Top 0.254: U4.10 9.31,40.39 R6.1 8.06,40.71 7.62,41.15 7.62,42.16 7.37,42.42 6.44,42.42
  Top 0.305: 6.44,42.42 R5.2
PB0/ICP
  Top 0.254: LED1.C 44.96,36.07 44.6,36.43 U1.12
PB1/OC1A
  Top 0.254: U1.13 44.94,37.23 47.12,35.05 LED2.C
PB2/SS/OC1B
  Top 0.254: LED3.C 49.28,34.04 45.66,37.66 45.34,37.97 45.28,38.03 U1.14
PB3/MOSI/OC2
  Top 0.254: U1.15 46.39,38.83 56.77,28.45 56.77,22.48 55.63,21.34 ICSP.4
PB4/MISO
  Top 0.254: U1.16 46.98,39.63 52.96,33.66 R7.1 55.95,32.06 58.04,29.97 ICSP.1
  Top 0.406: R7.1 55.88,33.66
PB5/SCK  (via drill 0.36)
  Top 0.254: R8.1 v52.7,36.2 47.75,41.15 41.18,41.15
  Top 0.406: 41.18,41.15 U1.17
  Bottom 0.254: ICSP.3 55.5,28.07 52.7,30.86 v52.7,36.2
PB6/XTAL1
  Top 0.254: U1.7 40.35,31.21 39.69,30.55 Y1.1
PB7/XTAL2
  Top 0.254: Y1.3 42.09,30.42 41.15,31.36 U1.8
PC0/ADC0  (via drill 0.36)
  Top 0.254: U4.1 U4.2 20.83,36.58 v23.56,39.31 23.62,39.37 | U1.23 36.35,39.91 v35.81,39.37
  Bottom 0.254: v35.81,39.37 23.62,39.37 v23.56,39.31
PC1/ADC1  (via drill 0.36)
  Top 0.254: U4.6 U4.7 v23.75,42.93 | v34.92,42.93 35.56,42.29 U1.24
  Top 0.406: U1.24
  Bottom 0.254: v23.75,42.93 v34.92,42.93
PC2/ADC2  (via drill 0.84)
  Top 0.254: U1.25 34.06,41.12 v34.04,41.15
PC3/ADC3  (via drill 0.84)
  Top 0.254: v32.38,41.15 32.38,39.62 33.18,38.83 U1.26
PC4/ADC4/SDA  (via drill 0.84)
  Top 0.254: U1.27 32.96,38.03 31.88,39.12 29.59,39.12 28.83,39.88 v28.83,41.15 R13.1
PC5/ADC5/SCL  (via drill 0.84)
  Top 0.254: U1.28 32.75,37.23 31.88,38.1 27.43,38.1 26.54,38.99 v26.54,41.15 R14.1
PC6/!RESET  (via drill 0.36)
  Top 0.254: S1.3 6.63,25.51 C1.2 R1.1 8.04,30.52 8.64,31.11 v13.08,31.11 | 34.08,36.45 35.05,36.45 36.2,35.31 39.88,35.31 v42.67,32.51 | U1.29 v30.63,36.43
  Top 0.406: 34.08,36.45 U1.29
  Bottom 0.254: v13.08,31.11 20.07,31.11 25.38,36.43 v30.63,36.43 | ICSP.5 52.96,28.32 48.77,32.51 v42.67,32.51
PD0/RXD  (via drill 0.36, 0.84)
  Top 0.254: U2.2 v31.62,32.38 | v22.61,31.62 26.61,35.63 v31.62,35.63 U1.30
  Bottom 0.254: v31.62,32.38 v31.62,35.63
PD1/TXD  (via drill 0.84)
  Top 0.254: U1.31 31.78,34.83 30.35,33.4 30.35,31.62 | 30.35,31.62 U2.3 | 30.35,31.62 v26.04,31.62
PD2/INT0  (via drill 0.84)
  Top 0.254: U1.32 34.06,32.66 v34.04,32.64
PD3/INT1  (via drill 0.84)
  Top 0.254: U1.1 35.55,30.36 v35.56,30.23
PD4/XCK/T0  (via drill 0.36)
  Top 0.254: v43.18,48.26 42.16,49.28 U5.5 | U1.2 36.35,31.21 v36.7,30.86 | U3.3 39.39,46.72 v41.53,44.58
  Top 0.406: U3.3 39.18,46.42
  Bottom 0.254: v36.7,30.86 39.5,30.86 41.53,32.89 v41.53,44.58 41.53,46.61 v43.18,48.26
PD5/T1  (via drill 0.36)
  Top 0.254: v43.31,46.23 40.89,48.64 U5.6 | U1.9 43.94,34.03 v44.07,34.04
  Bottom 0.254: v43.31,46.23 45.59,43.94 45.59,35.56 v44.07,34.04
PD6/AIN0  (via drill 0.36)
  Top 0.254: U1.10 41.75,34.83 40.13,36.45 37.59,36.45 36.96,37.08 v36.96,38.73 | U5.11 34.54,64.52 32,61.98 32,54.1 34.16,51.94 v34.16,43.94
  Bottom 0.254: v34.16,43.94 35.43,43.94 37.21,42.16 37.21,38.99 v36.96,38.73
PD7/AIN1  (via drill 0.36)
  Top 0.254: v44.7,54.36 v44.7,43.18 39.88,48.01 37.59,48.01 37.28,47.69 U3.1 | U1.11 44.01,35.63 v44.07,35.69 | U5.10 35.81,57.02 v38.48,54.36
  Bottom 0.254: v38.48,54.36 v44.7,54.36 | v44.7,43.18 44.7,36.32 v44.07,35.69
RJ_RX_1
  Bottom 0.61: RX.3 RX.5 | RX.5 RX.7 | RX.5 SJ2.1
RJ_RX_2
  Bottom 0.61: SJ4.1 RX.6 | RX.6 RX.8 | RX.6 RX.4
RJ_TX_1
  Bottom 0.61: TX.3 TX.5 | TX.5 TX.7 | SJ1.1 TX.5
RJ_TX_2
  Bottom 0.61: TX.4 TX.6 | TX.6 TX.8 | SJ3.1 TX.6
RS485_RX
  Top 0.254: 32.93,22.19 32.93,21.42 33.91,20.45 33.91,19.72 40.85,19.72 47.62,12.95 47.62,11.3 46.86,10.54 46.23,10.54 RX.1
  Top 0.406: 32.93,22.19 32.89,22.23 U2.8 | 33.91,19.72 R12.2
RS485_TX
  Top 0.254: U2.5 29.08,21.46 28.01,20.39 R9.2 28.01,19.71 26.92,18.63 26.92,16.93 | 26.8,16.8 26.8,9.91 TX.1
  Top 0.406: 26.84,17.02 R11.1 | 26.92,16.93 R11.1 | 26.8,16.8 R11.1
SENSE_A  (via drill 0.36)
  Top 0.254: U4.3 19.56,37.85 v21.08,39.37 | R3.2 47.92,50.33 v46.86,49.28
  Top 0.61: U5.1 47.24,62.23 48.01,61.47 48.01,54.95 R3.2
  Bottom 0.254: v21.08,39.37 21.08,48.13 22.23,49.28 v46.86,49.28
SENSE_B  (via drill 0.36)
  Top 0.254: v28.57,51.18 28.57,54.83 R4.2 | v15.62,40.39 U4.5
  Top 0.61: U5.15 29.46,62.48 28.57,61.59 28.57,54.9 R4.2
  Bottom 0.254: v28.57,51.18 17.27,51.18 15.62,49.53 v15.62,40.39
SPI_MISO
  Top 0.254: LED.2 R7.2
SPI_SCK
  Top 0.254: R8.2 LED.3
TP1
  Top 0.254: U4.12 PAD1.1
(copper drawn outside any net)
  shapes: Bottom area x1, Top circle x13

### Text on the board
Top: SCL | SDA | TXD | RXD | TX | RX